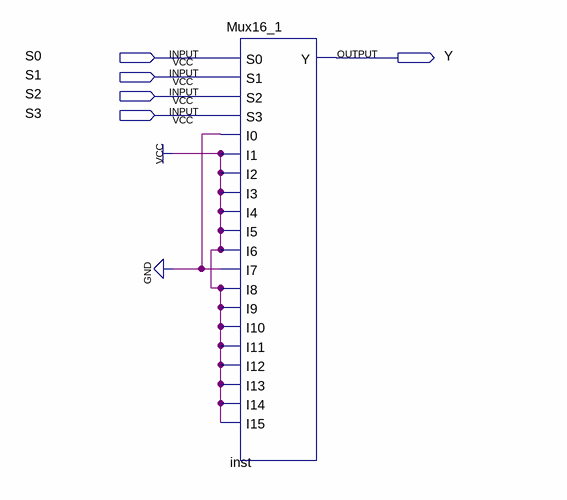
[diagram p0: schematic sheet]
// Quartus schematic MuxDemo3.bdf as structural Verilog: 1 symbols, 5 pins
module MuxDemo3 (
  input  S0,
  input  S1,
  input  S2,
  input  S3,
  output Y
);

  Mux16_1 inst (
    .S0(S0), .S1(S1), .S2(S2), .S3(S3), .I0(1'b0), .I1(1'b1), .I2(1'b1), .I3(1'b1), .I4(1'b1), .I5(1'b1),
    .I6(1'b1), .I7(1'b0), .I8(1'b1), .I9(1'b1), .I10(1'b1), .I11(1'b1), .I12(1'b1), .I13(1'b1), .I14(1'b1),
    .I15(1'b1), .Y(Y));
endmodule
